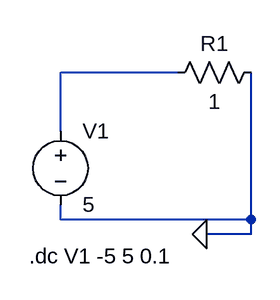
[diagram p0: schematic Draft2.asc]
Draft2.asc, the LTspice schematic file:
Version 4
SHEET 1 880 680
WIRE 160 64 32 64
WIRE 32 128 32 64
WIRE 32 224 32 208
WIRE 240 224 240 64
WIRE 240 224 32 224
WIRE 240 240 240 224
WIRE 240 240 192 240
FLAG 192 240 0
SYMBOL voltage 32 112 R0
SYMATTR InstName V1
SYMATTR Value 5
SYMBOL res 256 48 R90
WINDOW 0 0 56 VBottom 2
WINDOW 3 32 56 VTop 2
SYMATTR InstName R1
SYMATTR Value 1
TEXT -2 264 Left 2 !.dc V1 -5 5 0.1

The netlist it stands for:
* Draft2.asc
V1 N001 0 5
R1 0 N001 1
.dc V1 -5 5 0.1
.backanno
.end